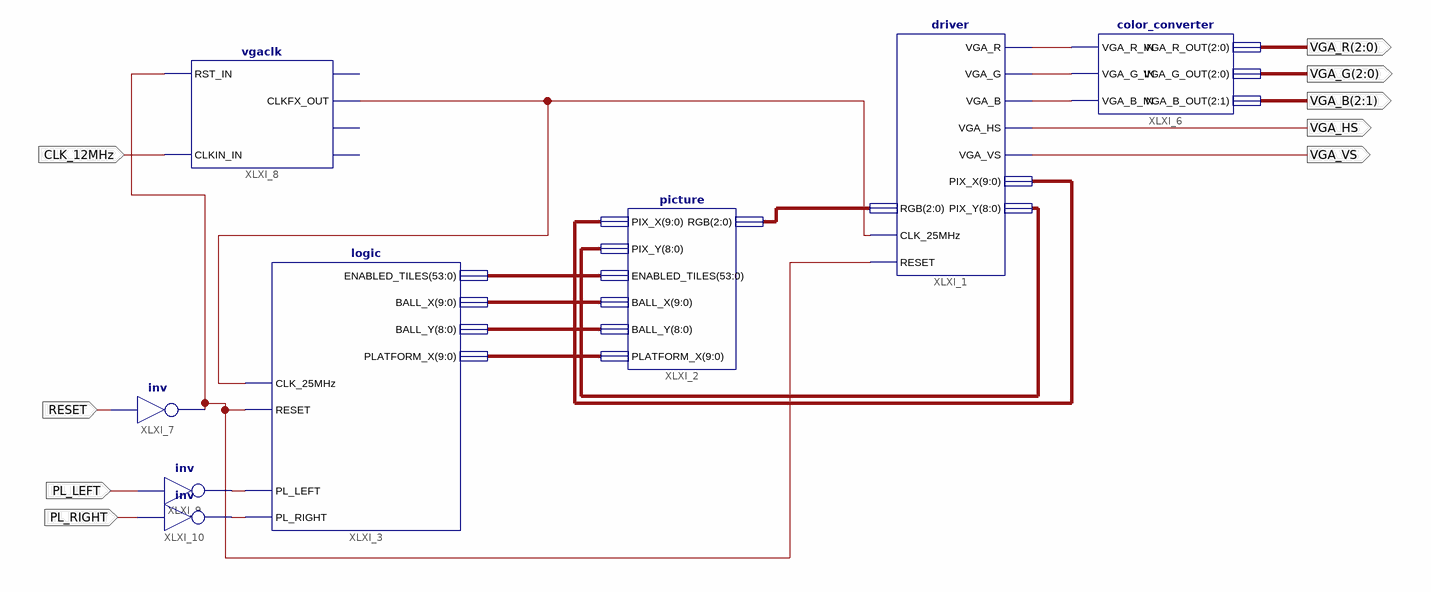
[diagram p0: schematic sheet 1]
// Xilinx ISE schematic breakout.sch (spartan3a) as structural Verilog: 8 symbols, 9 ports
module breakout (
  input  RESET,
  input  CLK_12MHz,
  input  PL_LEFT,
  input  PL_RIGHT,
  output VGA_HS,
  output VGA_VS,
  output [2:0] VGA_R,
  output [2:0] VGA_G,
  output [2:1] VGA_B
);

  wire XLXN_28, XLXN_36, XLXN_37, XLXN_38, XLXN_49, XLXN_55, XLXN_56;
  wire [2:0] XLXN_2;
  wire [8:0] XLXN_5, XLXN_14;
  wire [9:0] XLXN_4, XLXN_13, XLXN_15;
  wire [53:0] XLXN_12;

  driver XLXI_1 (
    .CLK_25MHz(XLXN_28), .RGB(XLXN_2), .VGA_R(XLXN_36), .VGA_G(XLXN_37), .VGA_B(XLXN_38), .VGA_HS(VGA_HS),
    .VGA_VS(VGA_VS), .PIX_X(XLXN_4), .PIX_Y(XLXN_5), .RESET(XLXN_49));
  picture XLXI_2 (
    .PIX_X(XLXN_4), .PIX_Y(XLXN_5), .ENABLED_TILES(XLXN_12), .BALL_X(XLXN_13), .BALL_Y(XLXN_14),
    .PLATFORM_X(XLXN_15), .RGB(XLXN_2));
  \logic  XLXI_3 (
    .CLK_25MHz(XLXN_28), .RESET(XLXN_49), .PL_LEFT(XLXN_55), .PL_RIGHT(XLXN_56), .ENABLED_TILES(XLXN_12),
    .BALL_X(XLXN_13), .BALL_Y(XLXN_14), .PLATFORM_X(XLXN_15));
  color_converter XLXI_6 (
    .VGA_R_IN(XLXN_36), .VGA_G_IN(XLXN_37), .VGA_B_IN(XLXN_38), .VGA_R_OUT(VGA_R), .VGA_G_OUT(VGA_G),
    .VGA_B_OUT(VGA_B));
  not XLXI_7 (XLXN_49, RESET);
  vgaclk XLXI_8 (
    .RST_IN(XLXN_49), .CLKIN_IN(CLK_12MHz), .CLKFX_OUT(XLXN_28));  // open: LOCKED_OUT, CLKIN_IBUFG_OUT, CLK0_OUT
  not XLXI_9 (XLXN_55, PL_LEFT);
  not XLXI_10 (XLXN_56, PL_RIGHT);
endmodule
